# EAGLE design minime_mini_2.1 (EAGLE 7.5.0)
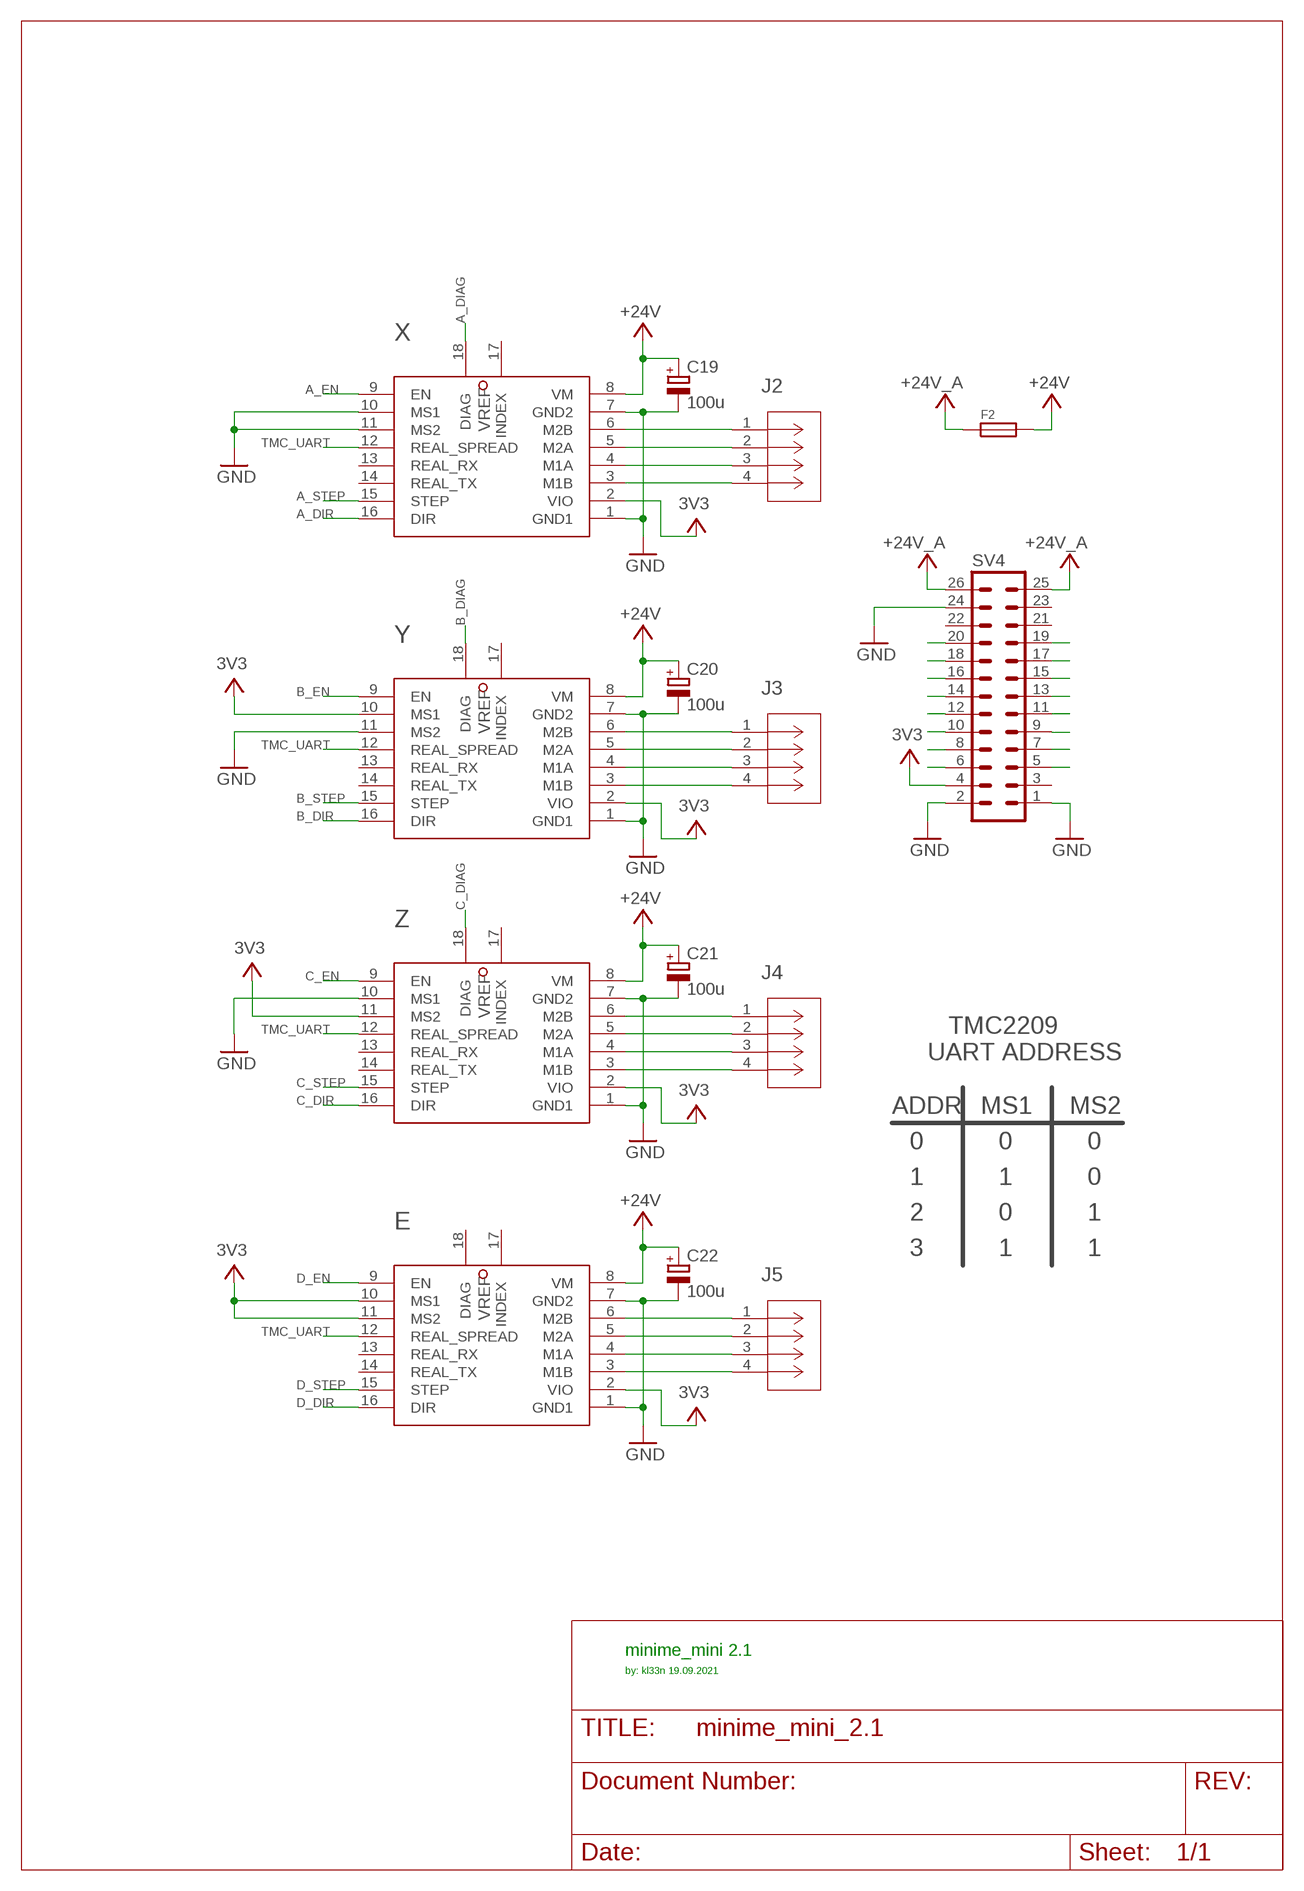
[diagram p0: schematic, sheet 1]

## Parts
C19  100u  CPOL-EU175TMP-0810  [175TMP-0810]
C20  100u  CPOL-EU175TMP-0810  [175TMP-0810]
C21  100u  CPOL-EU175TMP-0810  [175TMP-0810]
C22  100u  CPOL-EU175TMP-0810  [175TMP-0810]
F2  FUSE/SERIE154  [FUSE/NANO-OMNI]
J2  B4B-XH-AM(LF)(SN)  [CONN_B4B-XH-AM_JST]
J3  B4B-XH-AM(LF)(SN)  [CONN_B4B-XH-AM_JST]
J4  B4B-XH-AM(LF)(SN)  [CONN_B4B-XH-AM_JST]
J5  B4B-XH-AM(LF)(SN)  [CONN_B4B-XH-AM_JST]
SV4  MA13-2  [MA13-2]
U$1  TMC2209  [TMC2209]
U$2  TMC2209  [TMC2209]
U$3  TMC2209  [TMC2209]
U$4  TMC2209  [TMC2209]

## Nets
3V3: SV4.4 U$1.2(VIO) U$1.10(MS1) U$2.2(VIO) U$3.2(VIO) U$3.11(MS2) U$4.2(VIO) U$4.10(MS1) U$4.11(MS2)
+24V: C19.+ C20.+ C21.+ C22.+ F2.2 U$1.8(VM) U$2.8(VM) U$3.8(VM) U$4.8(VM)
+24V_A: F2.1 SV4.25 SV4.26
A_DIAG: SV4.5 U$2.18(DIAG)
A_DIR: SV4.8 U$2.16(DIR)
A_EN: SV4.6 U$2.9(EN)
A_STEP: SV4.7 U$2.15(STEP)
B_DIAG: SV4.14 U$1.18(DIAG)
B_DIR: SV4.17 U$1.16(DIR)
B_EN: SV4.15 U$1.9(EN)
B_STEP: SV4.16 U$1.15(STEP)
C_DIAG: SV4.9 U$3.18(DIAG)
C_DIR: SV4.12 U$3.16(DIR)
C_EN: SV4.10 U$3.9(EN)
C_STEP: SV4.11 U$3.15(STEP)
D_DIR: SV4.20 U$4.16(DIR)
D_EN: SV4.18 U$4.9(EN)
D_STEP: SV4.19 U$4.15(STEP)
GND: C19.- C20.- C21.- C22.- SV4.1 SV4.2 SV4.24 U$1.1(GND1) U$1.7(GND2) U$1.11(MS2) U$2.1(GND1) U$2.7(GND2) U$2.10(MS1) U$2.11(MS2) U$3.1(GND1) U$3.7(GND2) U$3.10(MS1) U$4.1(GND1) U$4.7(GND2)
N$5: J2.1 U$2.6(M2B)
N$6: J2.2 U$2.5(M2A)
N$7: J2.3 U$2.4(M1A)
N$8: J2.4 U$2.3(M1B)
N$9: J3.1 U$1.6(M2B)
N$10: J3.2 U$1.5(M2A)
N$12: J3.3 U$1.4(M1A)
N$13: J3.4 U$1.3(M1B)
N$14: J4.1 U$3.6(M2B)
N$15: J4.2 U$3.5(M2A)
N$16: J4.3 U$3.4(M1A)
N$17: J4.4 U$3.3(M1B)
N$18: J5.1 U$4.6(M2B)
N$19: J5.2 U$4.5(M2A)
N$20: J5.3 U$4.4(M1A)
N$21: J5.4 U$4.3(M1B)
TMC_UART: SV4.13 U$1.12(REAL_SPREAD) U$2.12(REAL_SPREAD) U$3.12(REAL_SPREAD) U$4.12(REAL_SPREAD)
Unconnected: SV4.3 SV4.21 SV4.22 SV4.23 U$1.13(REAL_RX) U$1.14(REAL_TX) U$1.17(INDEX) U$2.13(REAL_RX) U$2.14(REAL_TX) U$2.17(INDEX) U$3.13(REAL_RX) U$3.14(REAL_TX) U$3.17(INDEX) U$4.13(REAL_RX) U$4.14(REAL_TX) U$4.17(INDEX) U$4.18(DIAG)

## Notes on the sheet
- X
- Y
- Z
- TMC2209
  UART ADDRESS
- ADDR | MS1 | MS2
- 0 | 0 | 0
- 1 | 1 | 0
- 2 | 0 | 1
- E
- 3 | 1 | 1
- minime_mini 2.1
- by: kl33n 19.09.2021

## Library data of the parts
C19-C22 = rcl:CPOL-EU: POLARIZED CAPACITOR, European symbol
F2 = RPG_parts:FUSE/SERIE154: FUSE, with Holder, Serie 154, SMD OMNI-BLOK
J2-J5 = B4B-XH-A:B4B-XH-AM(LF)(SN); BUILT_BY: EMA_Cory; COPYRIGHT: Copyright (C) 2018 Accelerated Designs. All rights reserved; DATASHEET: http://www.jst-mfg.com/product/pdf/eng/eXH.pdf; MANUFACTURER_PART_NUMBER: B4B-XH-AM(LF)(SN); SOURCELIBRARY: Add_to_database_2020-12-30; VENDOR: JST
SV4 = con-lstb:MA13-2: PIN HEADER; OC_FARNELL: unknown; OC_NEWARK: unknown
U$1-U$4 = TMC2209:TMC2209

## Board
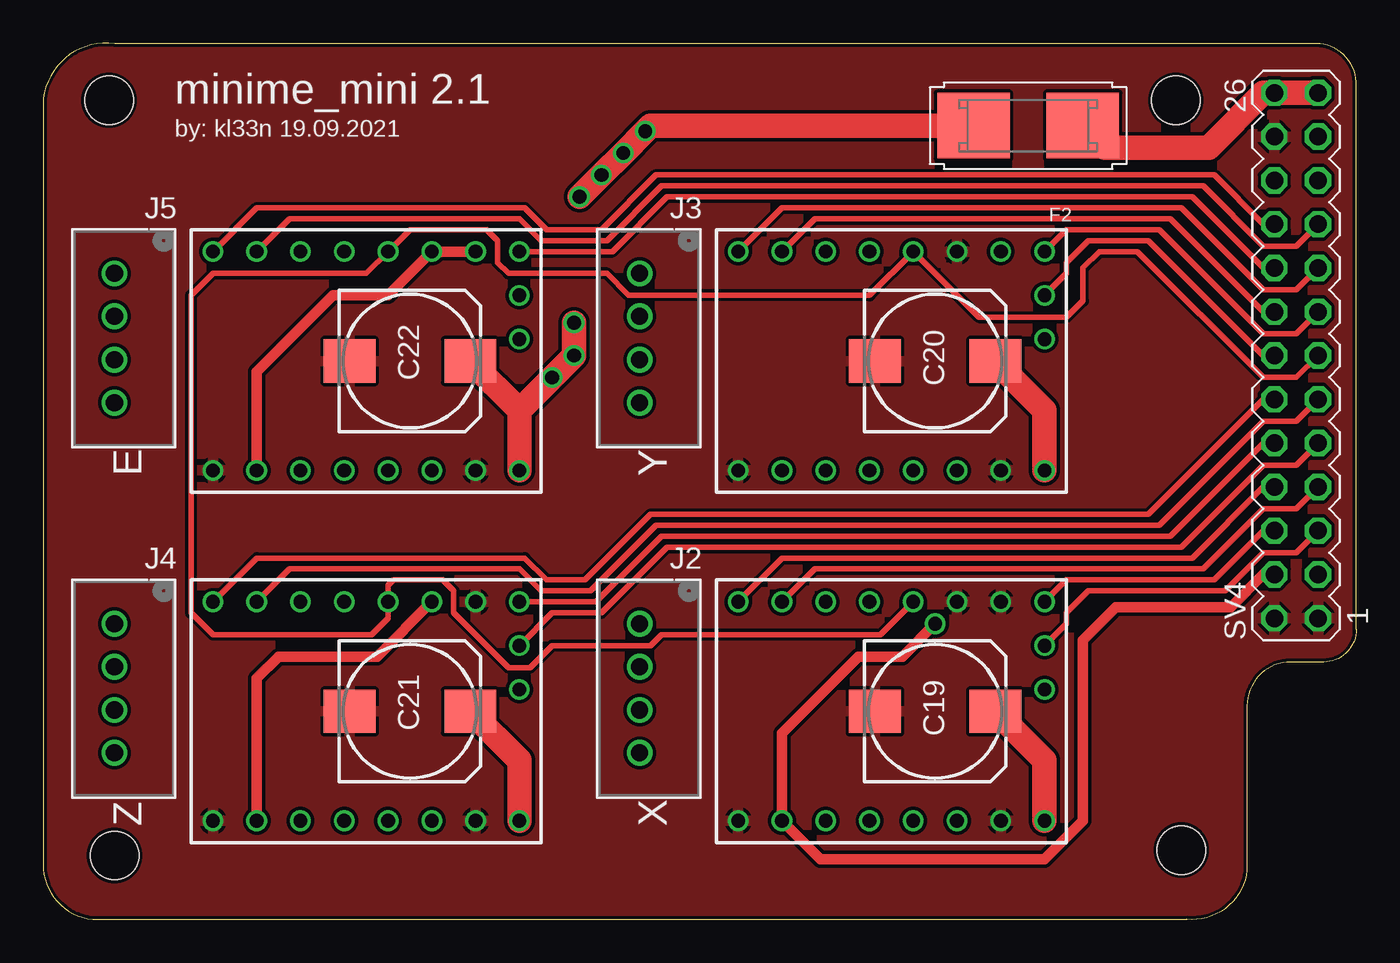
[diagram p1: board, top side]
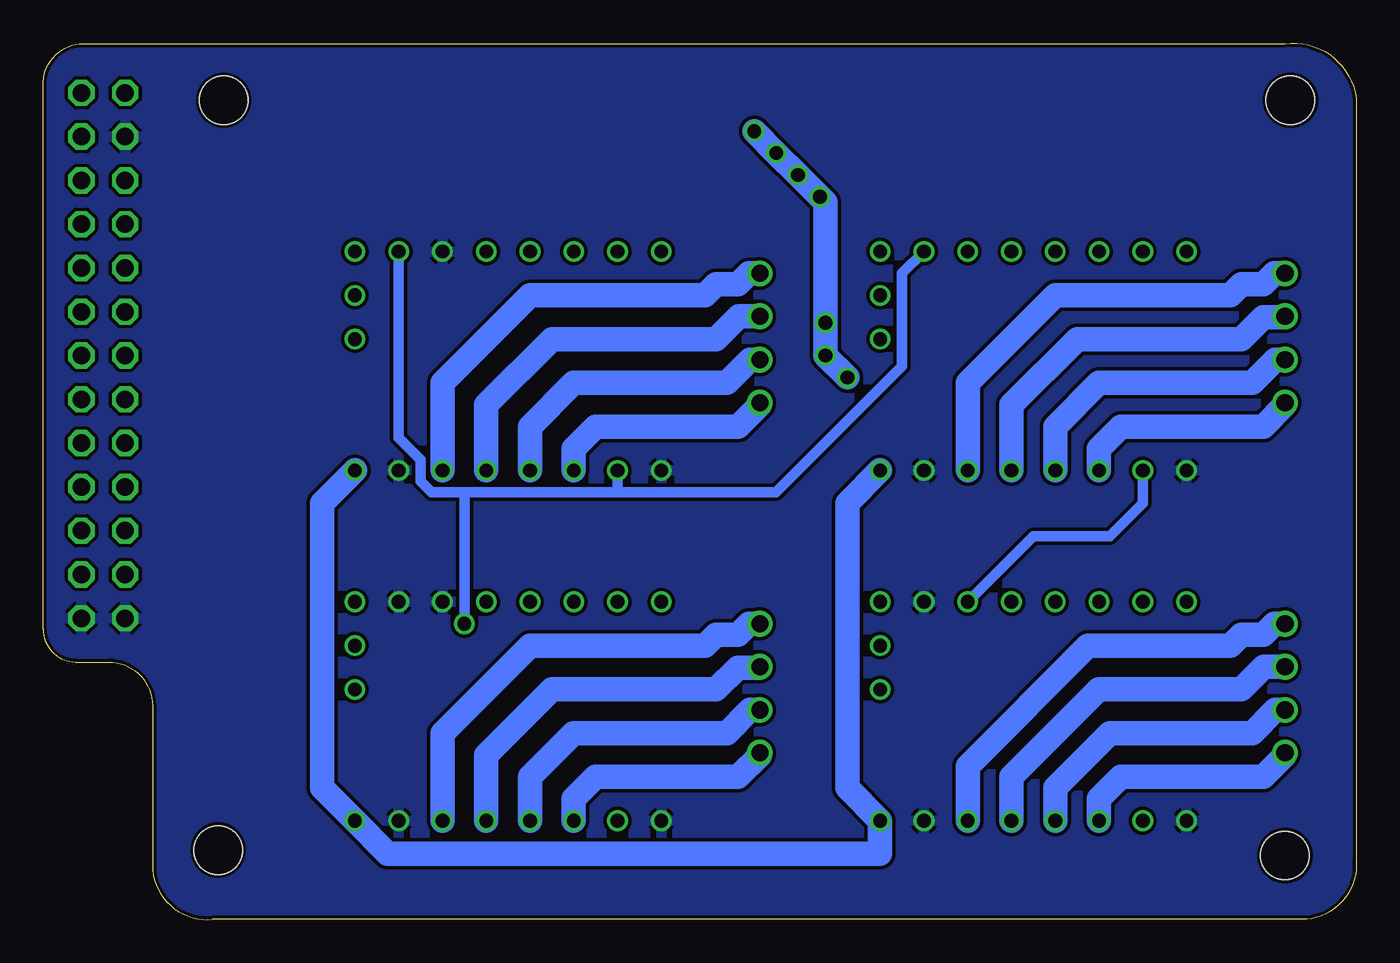
[diagram p2: board, bottom side, seen from below]

Size 76.22 x 50.84 mm. Coordinates in mm from the lower left corner, seen from the top.
Outline: 0.02,47.64 0.02,3.51 arc90 2.87,0.02 66.37,0.02 arc90 69.87,2.87 69.87,12.4 arc-90 72.41,14.94 74.31,14.94 arc90 76.22,16.84 76.22,48.59 arc90 73.68,50.82 4.14,50.82 arc90 0.02,47.64
Copper layers (1*16): Top 0.018mm / dielectric 1.55mm / Bottom 0.018mm
Design rules "Multi-CB_2L_100µm-Tracks_OL35µm": minimum track width 0.1mm, minimum drill 0.2mm, track to track 0.1mm, track to pad 0.1mm, pad to pad 0.1mm, via to via 0.1mm, smd to smd 0mil, copper to edge 0.2mm, drill to drill 0.2mm, minimum pad ring 0.125mm, minimum via ring 0.1mm, stop-mask expansion 2mil, vias tented up to drill 0.45mm, thermal gap 0.2mm
Holes 2.8 mm at 3.83,47.53 4.14,3.72 65.74,47.53 66.06,4.03

### Footprints (pad centres in the part's own frame; a part is rotated, then mirrored left to right if it is on the bottom)
175TMP-0810 = smd 3 x 2.5: + 3.5,0; - -3.5,0
FUSE/NANO-OMNI = smd 4.2 x 3.8: 1 -3.17,0; 2 3.17,0
CONN_B4B-XH-AM_JST = drill 0.991 pad 1.499: 1 0,0; 2 2.489,0; 3 5.004,0; 4 7.493,0
MA13-2 = drill 1.016 octagon: 1 -15.24,-1.27; 2 -15.24,1.27; 3 -12.7,-1.27; 4 -12.7,1.27; 5 -10.16,-1.27; 6 -10.16,1.27; 7 -7.62,-1.27; 8 -7.62,1.27; 9 -5.08,-1.27; 10 -5.08,1.27; 11 -2.54,-1.27; 12 -2.54,1.27; 13 0,-1.27; 14 0,1.27; 15 2.54,-1.27; 16 2.54,1.27; 17 5.08,-1.27; 18 5.08,1.27; 19 7.62,-1.27; 20 7.62,1.27; 21 10.16,-1.27; 22 10.16,1.27; 23 12.7,-1.27; 24 12.7,1.27; 25 15.24,-1.27; 26 15.24,1.27
TMC2209 = drill 0.8: 1 -12.7,7.62; 2 -12.7,5.08; 3 -12.7,2.54; 4 -12.7,0; 5 -12.7,-2.54; 6 -12.7,-5.08; 7 -12.7,-7.62; 8 -12.7,-10.16; 9 0,-10.16; 10 0,-7.62; 11 0,-5.08; 12 0,-2.54; 13 0,0; 14 0,2.54; 15 0,5.08; 16 0,7.62; 17 -5.08,-10.16; 18 -2.54,-10.16

### Placement (x,y rotation side)
C19  51.77,12.08 0 top
C20  51.77,32.4 0 top
C21  21.29,12.08 0 top
C22  21.29,32.4 0 top
F2  57.17,46.05 180 top
J2  34.62,17.16 270 top
J3  34.62,37.48 270 top
J4  4.14,17.16 270 top
J5  4.14,37.48 270 top
SV4  72.72,32.72 90 top
U$1  47.96,38.75 90 top
U$2  47.96,18.43 90 top
U$3  17.48,18.43 90 top
U$4  17.48,38.75 90 top

### Tracks (layer width: path | path; a pad name or v marks a point on that pad's centre or on a via)
3V3  (via drill 0.8)
  Top 0.61: U$4.10 U$4.11 20.02,36.21 16.84,36.21 12.4,31.77 U$4.2 | U$3.2 12.4,13.99 13.67,15.26 19.38,15.26 U$3.11 | v51.77,17.16 49.86,15.26 47.32,15.26 42.88,10.81 U$2.2 45.1,3.51 58.12,3.51 60.34,5.73 60.34,16.21 62.25,18.11 68.91,18.11 70.82,20.02 SV4.4
  Bottom 0.61: U$1.10 55.58,27.96 54.31,26.69 54.31,25.42 53.67,24.78 51.77,24.78 | 51.77,24.78 42.88,24.78 | 42.88,24.78 33.67,24.78 26.37,32.08 26.37,37.48 U$4.10 | v51.77,17.16 51.77,24.78 | U$4.2 12.4,24.15 14.3,22.24 18.75,22.24 U$3.11 | U$1.2 42.88,24.78
+24V  (via drill 0.8)
  Top 1.422: U$2.8 58.12,9.23 C19.+ | U$1.8 58.12,29.55 C20.+ | 27.64,29.54 27.64,29.55 C22.+ 27.64,29.54 | U$3.8 27.64,9.22 | 27.64,9.22 27.64,9.23 C21.+ 27.64,9.22 | 27.64,29.54 v30.81,32.72 v30.81,34.62 | U$4.8 27.64,29.54 | v31.13,41.93 v32.4,43.2 v33.67,44.47 v34.94,45.74 35.26,46.05 F2.2
  Bottom 1.422: U$1.8 60.02,24.15 60.02,7.64 U$2.8 56.21,3.83 27.64,3.83 U$3.8 29.54,7.64 29.54,24.15 U$4.8 | v29.54,31.45 v30.81,32.72 v30.81,34.62 30.81,41.61 v32.4,43.2 v33.67,44.47 v34.94,45.74
+24V_A
  Top 1.422: F2.1 61.61,44.78 67.64,44.78 70.82,47.96 SV4.26 SV4.25
A_DIAG
  Top 0.305: U$2.18 59.39,17.16 59.39,17.8 60.66,19.07 68.6,19.07 70.82,21.29 72.72,21.29 SV4.5
A_DIR
  Top 0.305: U$2.16 42.88,20.97 66.69,20.97 70.82,25.1 SV4.8
A_EN
  Top 0.305: U$2.9 59.39,19.7 67.96,19.7 70.82,22.56 SV4.6
A_STEP
  Top 0.305: U$2.15 44.78,20.34 67.33,20.34 70.82,23.83 72.72,23.83 SV4.7
B_DIAG
  Top 0.305: U$1.18 59.39,37.48 59.39,38.12 60.66,39.39 64.15,39.39 70.82,32.72 SV4.14
B_DIR
  Top 0.305: U$1.16 42.88,41.29 66.06,41.29 70.82,36.53 72.72,36.53 SV4.17
B_EN
  Top 0.305: U$1.9 59.39,40.02 64.79,40.02 70.82,33.99 72.72,33.99 SV4.15
B_STEP
  Top 0.305: U$1.15 44.78,40.66 65.42,40.66 70.82,35.26 SV4.16
C_DIAG
  Top 0.305: U$3.18 29.54,17.8 32.4,17.8 36.21,21.61 66.06,21.61 70.82,26.37 72.72,26.37 SV4.9
C_DIR
  Top 0.305: U$3.16 12.4,20.97 27.96,20.97 29.23,19.7 31.45,19.7 35.26,23.51 64.15,23.51 70.82,30.18 SV4.12
C_EN
  Top 0.305: U$3.9 32.08,18.43 35.89,22.24 65.42,22.24 70.82,27.64 SV4.10
C_STEP
  Top 0.305: U$3.15 14.3,20.34 27.64,20.34 28.91,19.07 31.77,19.07 35.58,22.88 64.79,22.88 70.82,28.91 72.72,28.91 SV4.11
D_DIR
  Top 0.305: U$4.16 12.4,41.29 27.96,41.29 29.23,40.02 32.4,40.02 35.58,43.2 67.96,43.2 70.82,40.34 SV4.20
D_EN
  Top 0.305: U$4.9 33.04,38.75 36.21,41.93 66.69,41.93 70.82,37.8 SV4.18
D_STEP
  Top 0.305: U$4.15 14.3,40.66 27.64,40.66 28.91,39.39 32.72,39.39 35.89,42.56 67.33,42.56 70.82,39.07 72.72,39.07 SV4.19
GND
  pour Bottom (isolate 0.2): 76.22,50.82 0.02,50.82 0.02,-0.3 76.22,-0.3
  pour Top (isolate 0.2, rank 2): 0.02,50.82 76.22,50.82 76.22,-0.3 0.02,-0.3
N$5
  Bottom 1.422: J2.1 35.26,17.16 35.89,16.53 37.16,16.53 37.8,15.89 47.96,15.89 53.04,10.81 U$2.6
N$6
  Bottom 1.422: U$2.5 50.5,9.54 46.69,13.35 37.16,13.35 35.89,14.62 34.67,14.62 J2.2
N$7
  Bottom 1.422: J2.3 35.18,12.16 36.53,10.81 45.42,10.81 47.96,8.27 U$2.4
N$8
  Bottom 1.422: J2.4 34.62,9.54 35.89,8.27 44.15,8.27 45.42,7 U$2.3
N$9
  Bottom 1.422: J3.1 35.26,37.48 35.89,36.85 37.16,36.85 37.8,36.21 47.96,36.21 53.04,31.13 U$1.6
N$10
  Bottom 1.422: U$1.5 50.5,29.86 46.69,33.67 37.16,33.67 35.84,34.99 J3.2
N$12
  Bottom 1.422: J3.3 35.18,32.48 36.53,31.13 45.42,31.13 47.96,28.59 U$1.4
N$13
  Bottom 1.422: J3.4 34.62,29.86 35.89,28.59 44.15,28.59 45.42,27.32 U$1.3
N$14
  Bottom 1.422: U$3.6 22.56,8.91 15.57,15.89 7.32,15.89 6.68,16.53 5.41,16.53 4.78,17.16 J4.1
N$15
  Bottom 1.422: J4.2 5.36,14.67 6.68,13.35 14.94,13.35 20.02,8.27 U$3.5
N$16
  Bottom 1.422: J4.3 4.7,12.16 6.05,10.81 14.3,10.81 17.48,7.64 U$3.4
N$17
  Bottom 1.422: J4.4 4.14,9.54 5.41,8.27 13.67,8.27 14.94,7 U$3.3
N$18
  Bottom 1.422: J5.1 4.78,37.48 5.41,36.85 6.68,36.85 7.32,36.21 17.48,36.21 22.56,31.13 U$4.6
N$19
  Bottom 1.422: U$4.5 20.02,29.86 16.21,33.67 6.68,33.67 5.41,34.94 4.19,34.94 J5.2
N$20
  Bottom 1.422: J5.3 4.7,32.48 6.05,31.13 14.94,31.13 17.48,28.59 U$4.4
N$21
  Bottom 1.422: J5.4 4.14,29.86 5.41,28.59 13.67,28.59 14.94,27.32 U$4.3
TMC_UART
  Top 0.305: U$2.12 48.59,16.53 35.89,16.53 35.26,15.89 29.54,15.89 28.27,14.62 27,14.62 23.83,17.8 23.83,19.07 23.19,19.7 20.34,19.7 20.02,19.38 U$3.12 20.02,17.48 19.07,16.53 9.86,16.53 8.59,17.8 8.59,36.21 9.86,37.48 18.75,37.48 U$4.12 21.29,40.02 25.73,40.02 26.37,39.39 26.37,38.12 27,37.48 32.72,37.48 33.99,36.21 47.96,36.21 U$1.12 54.31,34.94 59.39,34.94 60.34,35.89 60.34,37.8 61.29,38.75 63.52,38.75 70.82,31.45 72.72,31.45 SV4.13

### Text on the board
tNames: minime_mini 2.1 | by: kl33n 19.09.2021 | E | Y | Z | X